# EAGLE schematic INCUBATOR (EAGLE 9.6.2)
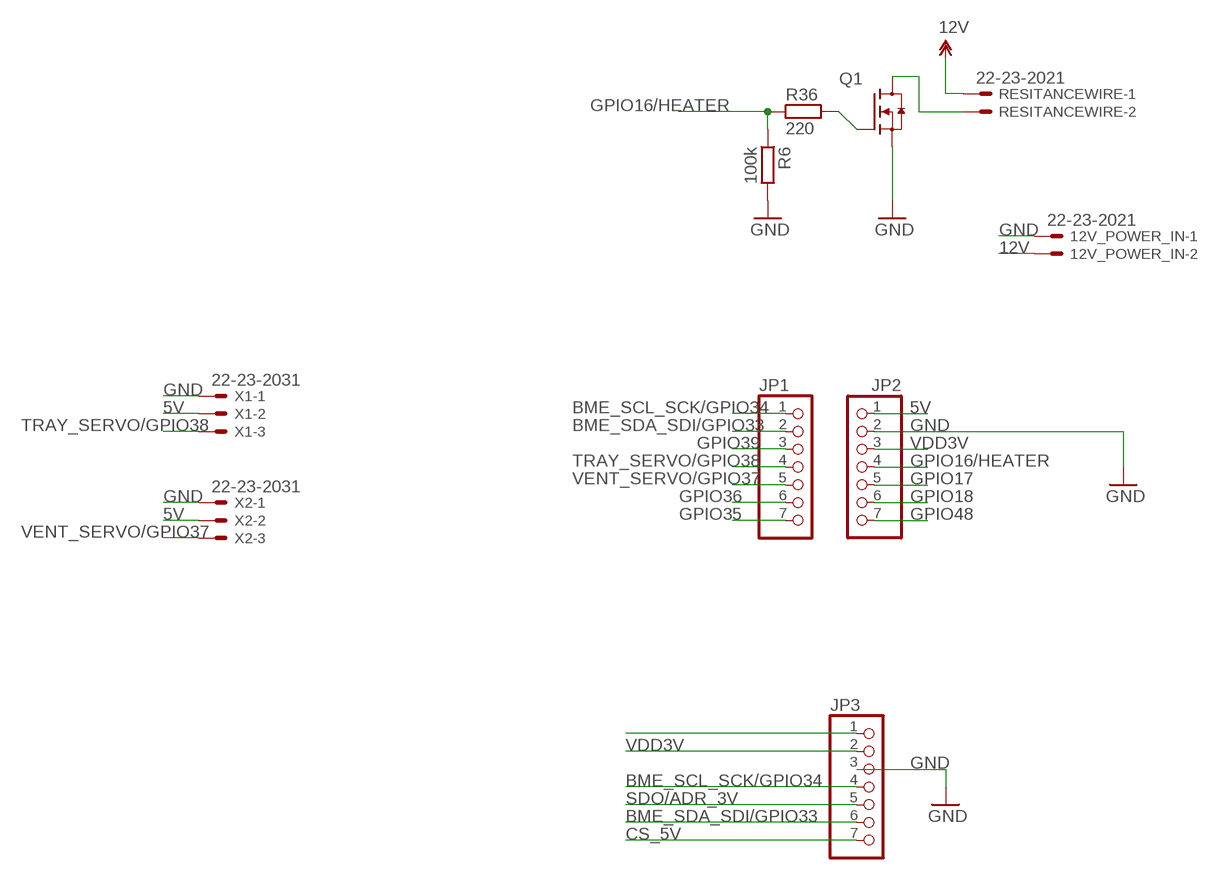
[diagram p0: schematic, sheet 1]

## Parts
12V_POWER_IN  22-23-2021  [22-23-2021]
JP1  PINHD-1X7  [1X07]
JP2  PINHD-1X7  [1X07]
JP3  HEADER-1X770MIL  [1X07_ROUND_70]
Q1  RFP30N06LE  TN0702N3-G  [TO92127P520H700-3]
R6  100k  RESISTOR_0805  [RESC2012X70N]
R36  220  RESISTOR_0805  [RESC2012X70N]
RESITANCEWIRE  22-23-2021  [22-23-2021]
X1  22-23-2031  [22-23-2031]
X2  22-23-2031  [22-23-2031]

## Nets
5V: JP2.1 X1.2 X2.2
12V: 12V_POWER_IN.2 RESITANCEWIRE.1
BME_SCL_SCK/GPIO34: JP1.1 JP3.4
BME_SDA_SDI/GPIO33: JP1.2 JP3.6
CS_5V: JP3.7
GND [power]: 12V_POWER_IN.1 JP2.2 JP3.3 Q1.S(SOURCE) R6.2 X1.1 X2.1
GPIO16/HEATER: JP2.4 R6.1 R36.1
GPIO17: JP2.5
GPIO18: JP2.6
GPIO35: JP1.7
GPIO36: JP1.6
GPIO39: JP1.3
GPIO48: JP2.7
HOTEND-GND [power]: Q1.D(DRAIN) RESITANCEWIRE.2
N$2: JP3.1
N$71: Q1.G(GATE) R36.2
SDO/ADR_3V: JP3.5
TRAY_SERVO/GPIO38: JP1.4 X1.3
VDD3V: JP2.3 JP3.2
VENT_SERVO/GPIO37: JP1.5 X2.3

## Library data of the parts
12V_POWER_IN RESITANCEWIRE = con-molex:22-23-2021: .100" (2.54mm) Center Header - 2 Pin; MF: MOLEX; MPN: 22-23-2021; OC_FARNELL: 1462926; OC_NEWARK: 25C3832
JP1 JP2 = pinhead:PINHD-1X7: PIN HEADER
JP3 = microbuilder:HEADER-1X7: PIN HEADER
Q1 = TO92127P520H700-3:TN0702N3-G: TN0702 N-Channel Enhancement-Mode Vertical DMOS FET from Supertex Inc.
R6 R36 = ipc-7351-resistor:RESISTOR_
X1 X2 = con-molex:22-23-2031: .100" (2.54mm) Center Header - 3 Pin; MF: MOLEX; MPN: 22-23-2031; OC_FARNELL: 1462950; OC_NEWARK: 30C0862